# Altium schematic sheet Amplifier.SchDoc
size B
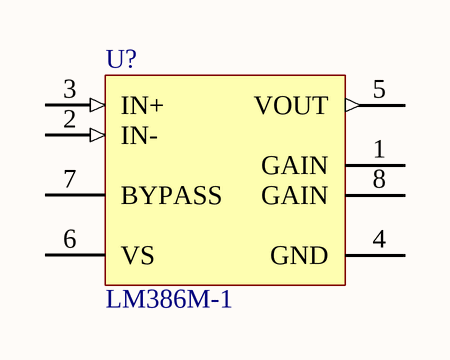
[diagram p0: Amplifier.SchDoc]

## Parts
U?  LM386M-1  [D0008A_M]

## Nets

Not connected (* = marked no-connect by the designer): U? 1(GAIN) 2(IN-) 3(IN+) 4(GND) 5(VOUT) 6(VS) 7(BYPASS) 8(GAIN)

## Notes on the sheet
- Title
- Size:
- Date:
- B
- Number:
- Time:
- Revision:
- Sheet
- of
- File:

## Library data of the parts
U? = CMP-0057-00421-4: Low Voltage Audio Power Amplifier, 8-pin Narrow SOIC; Manufacturer: Texas Instruments; PackageTopMarking: NSZXTT*LM386*M-1; CompType: Audio IC; PowerWise: N; ComponentLink1Description: Datasheet URL; Code_IPC: SOIC127P600-8; PackageDescription: SOIC Narrow, 4.9 x 3.9 x 1.45mm, 8 Lead, 1.27mm Pitch; Code_JEDEC: MS-012-AA; PinCount: 8; ComponentLink1URL: http://www.ti.com/general/docs/lit/getliterature.tsp?genericPartNumber=LM386&fileType=pdf; RoHS: N; PackageReference: D0008A